# EAGLE schematic juggling_ballsch_2 (EAGLE 6.5.0)
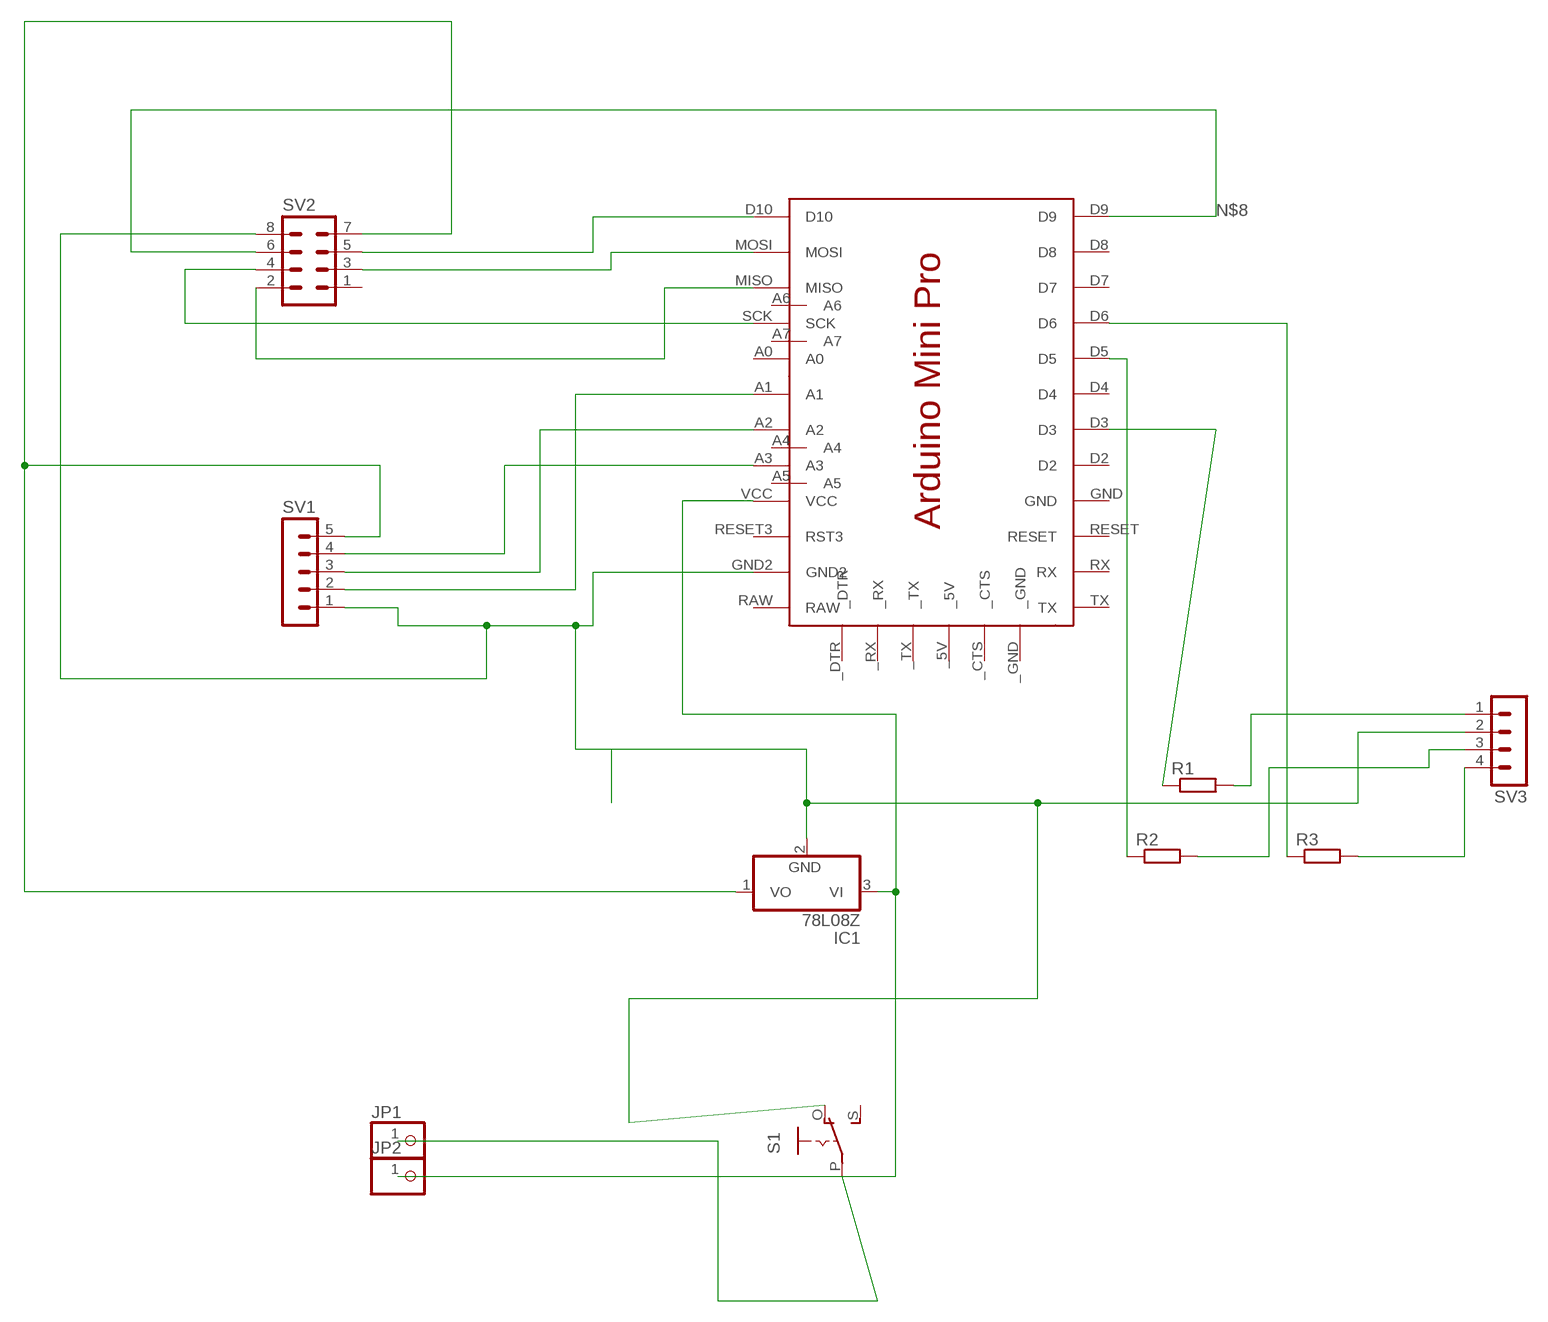
[diagram p0: schematic, sheet 1]

## Parts
IC1  78L08Z  [TO92]
JP1  PINHD-1X1  [1X01]
JP2  PINHD-1X1  [1X01]
R1  R-EU_0207/7  [0207/7]
R2  R-EU_0207/7  [0207/7]
R3  R-EU_0207/7  [0207/7]
S1  EG1218S  [EG1218]
SV1  MA05-1  [MA05-1]
SV2  MA04-2  [MA04-2]
SV3  MA04-1  [MA04-1]
U$1  ARDMINIPRO  [ARDMINIPRO]

## Nets
N$1: SV1.2 U$1.A1
N$2: SV1.3 U$1.A2
N$3: SV1.4 U$1.A3
N$4: IC1.2(GND) S1.O SV1.1 SV2.8 SV3.2 U$1.GND2
N$5: SV2.3 U$1.MOSI
N$6: SV2.5 U$1.D10
N$7: SV2.2 U$1.MISO
N$8: SV2.6 U$1.D9
N$9: SV2.4 U$1.SCK
N$11: IC1.1(VO) SV1.5 SV2.7
N$13: R1.1 U$1.D3
N$14: R2.1 U$1.D5
N$15: R3.1 U$1.D6
N$16: R1.2 SV3.1
N$17: R2.2 SV3.3
N$18: R3.2 SV3.4
N$19: JP1.1 S1.P
N$20: IC1.3(VI) JP2.1 U$1.VCC
Unconnected: S1.S SV2.1 U$1._5V U$1._CTS U$1._DTR U$1._GND U$1._RX U$1._TX U$1.A0 U$1.A4 U$1.A5 U$1.A6 U$1.A7 U$1.D2 U$1.D4 U$1.D7 U$1.D8 U$1.GND U$1.RAW U$1.RESET U$1.RESET3(RST3) U$1.RX U$1.TX

## Library data of the parts
IC1 = adafruit:78*: Positive VOLTAGE REGULATOR Added bigger pads to the TO-92 package
JP1 JP2 = adafruit:PINHD-1X1: Pin header 1x1 for 0.1" spacing With round pins
R1-R3 = resistor:R-EU_: RESISTOR, European symbol
S1 = adafruit:EG1218: SLIDING SWITCH 0.1" spacing through hole, vertical SPDT slide switch http://www.ladyada.net/library/pcb/eaglelibrary.html
SV1 = con-lstb:MA05-1: PIN HEADER; OC_FARNELL: unknown; OC_NEWARK: unknown
SV2 = con-lstb:MA04-2: PIN HEADER; OC_FARNELL: unknown; OC_NEWARK: unknown
SV3 = con-lstb:MA04-1: PIN HEADER; OC_FARNELL: unknown; OC_NEWARK: unknown
U$1 = Charlie:ARDMINIPRO